# Altium project TL494_Card.PrjPcb
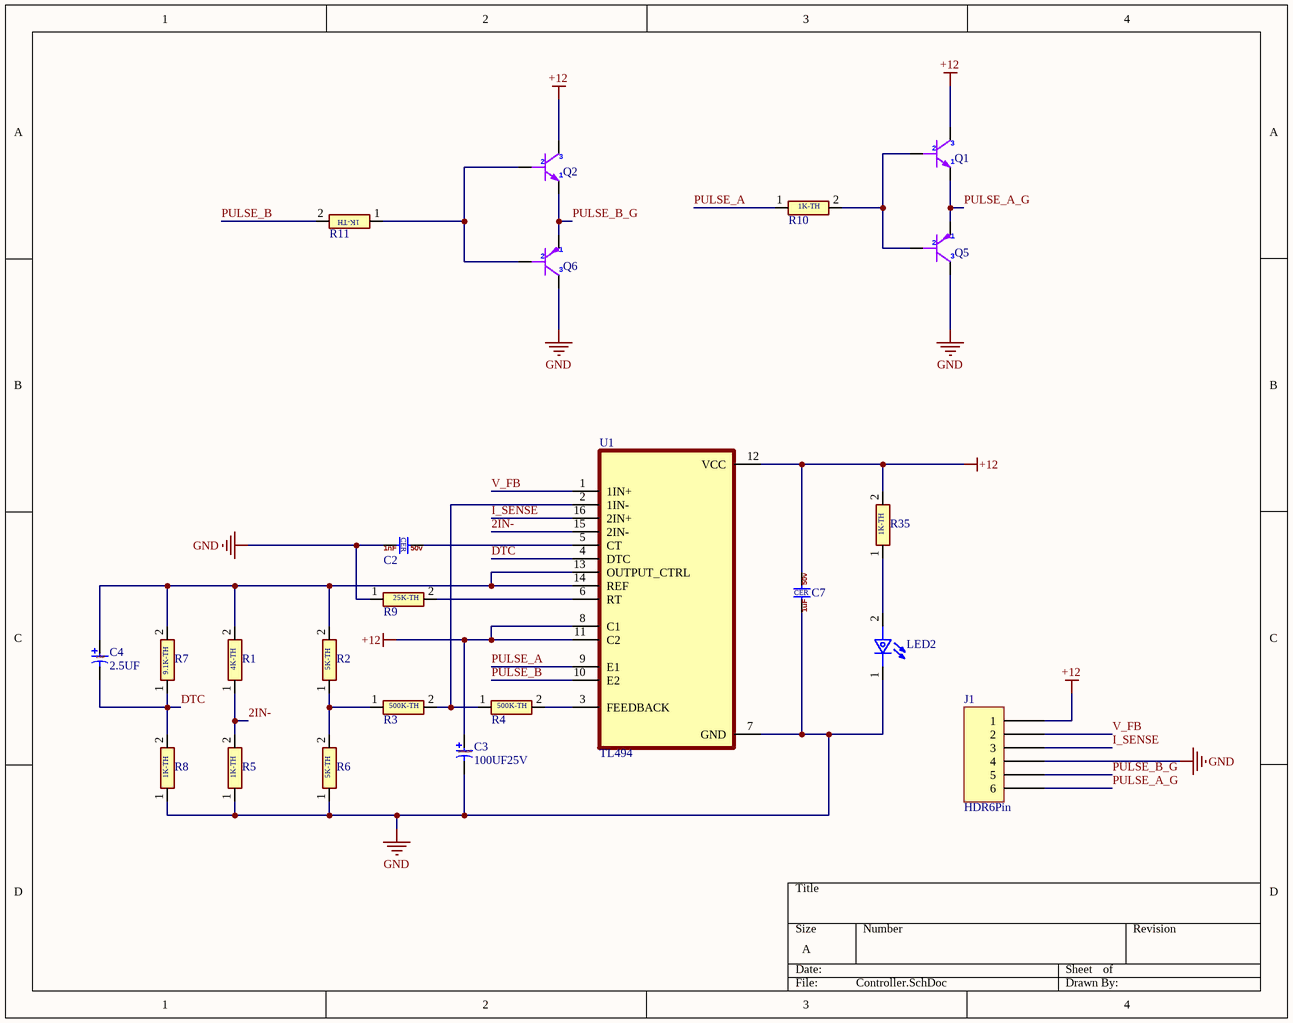
[diagram p0: Controller.SchDoc]
1 sheet, 23 parts. Net scope: global (net labels, ports and power ports of the same name join across sheets).
Board file: PCB1.PcbDoc

## Sheet Controller.SchDoc
size A; SheetNumber: 1; SheetTotal: 1; SPICEModelCacheHVBVXOZT: <root> / <DocumentId>HVBVXOZT</DocumentId> / </root>

### Parts
C2  1NFCER  [CAP-CER-2.54]  (value not drawn)
C3  100UF25V  [CAP LS-1.5mm D4 H5]
C4  2.5UF  [CAP LS-1.5mm D4 H5]
C7  1UFCER  [CAP-CER-2.54]  (value not drawn)
J1  HDR6Pin  [HDR-TH_6P-P2.54-V-F]
LED2  LED White TH  [LED_5mm P5MM WHITE]  (value not drawn)
Q1  SS8050  [TO-92]  (value not drawn)
Q2  SS8050  [TO-92]  (value not drawn)
Q5  SS8550  [TO-92]  (value not drawn)
Q6  SS8550  [TO-92]  (value not drawn)
R1  4K  [RES-TH-7mm]  (value not drawn)
R2  5K  [RES-TH-7mm]  (value not drawn)
R3  500R  [RES-TH-7mm]  (value not drawn)
R4  500K  [RES-TH-7mm]  (value not drawn)
R5  1K  [RES-TH-7mm]  (value not drawn)
R6  5K  [RES-TH-7mm]  (value not drawn)
R7  9.1K  [RES-TH-7mm]  (value not drawn)
R8  1K  [RES-TH-7mm]  (value not drawn)
R9  25K  [RES-TH-7mm]  (value not drawn)
R10  1K  [RES-TH-7mm]  (value not drawn)
R11  1K  [RES-TH-7mm]  (value not drawn)
R35  1K  [RES-TH-7mm]  (value not drawn)
U1  TL494  [DIP-16]

### Nets
+12: C3.1 C7.2 J1.1 Q1.3(C) Q2.3(C) R35.2 U1.8(C1) U1.11(C2) U1.12(VCC)
GND: C2.1 C3.2 C7.1 J1.4 LED2.1 Q5.3(C) Q6.3(C) R5.1 R6.1 R8.1 R9.1 U1.7(GND)
2IN-: R1.1 R5.2 U1.15(2IN-)
DTC: C4.2 R7.1 R8.2 U1.4(DTC)
I_SENSE: J1.3 U1.16(2IN+)
PULSE_A: R10.1 U1.9(E1)
PULSE_A_G: J1.6 Q1.1(E) Q5.1(E)
PULSE_B: R11.2 U1.10(E2)
PULSE_B_G: J1.5 Q2.1(E) Q6.1(E)
V_FB: J1.2 U1.1(1IN+)
NetC2_2: C2.2 U1.5(CT)
NetC4_1: C4.1 R1.2 R2.2 R7.2 U1.13(OUTPUT_CTRL) U1.14(REF)
NetLED2_2: LED2.2 R35.1
NetQ1_2: Q1.2(B) Q5.2(B) R10.2
NetQ2_2: Q2.2(B) Q6.2(B) R11.1
NetR2_1: R2.1 R3.1 R6.2
NetR3_2: R3.2 R4.1 U1.2(1IN-)
NetR4_2: R4.2 U1.3(FEEDBACK)
NetR9_2: R9.2 U1.6(RT)

### Notes on the sheet
- (in symbol 1K) 1K-TH
- (in symbol 1NFCER) CER; 1nF; 50v
- (in symbol 1UFCER) 50v; CER; 1uF
- (in symbol 2.5UF) 2.5uF
- (in symbol 4K) 4K-TH
- (in symbol 5K) 5K-TH
- (in symbol 9.1K) 9.1K-TH
- (in symbol 25K) 25K-TH
- (in symbol 100UF25V) 100u25v
- (in symbol 500K) 500K-TH
- (in symbol 500R) 500K-TH

### Library data of the parts
C2 = 1NFCER: CAP: CER 1UF 50V X7R 1206; LCSC Part #: C1848; Unit Price: 0.0104
C3 = 100UF25V: CAP TH AL: 100U 25V; LCSC Part #: C43351; Unit Price: 0.0057
C4 = 2.5UF: CAP TH AL: 2.5UF; LCSC Part #: C43351; Unit Price: 0.0057
C7 = 1UFCER: CAP: CER 1UF 50V; LCSC Part #: C1848; Unit Price: 0.0104
J1 = HDR6Pin: HEADER: 1*6P Male
LED2 = LED White TH: LED: White, Through Hole, T-1 3/4 (5mm), 30 mA, 2.1V / LS-5MM; LCSC Part #: C7470709
Q1 Q2 = SS8050: Transistor: 25V 300mW 120@100mA,1V 1.5A NPN SOT-23; LCSC Part #: C59205; Unit Price: 0.0048
Q5 Q6 = SS8550: Transistor: 25V 200mW 120@100mA,1V 1.5A PNP SOT-23 EVVO; LCSC Part #: C59205; Unit Price: 0.0048
R1 = 4K: RES TH: 4K
R2 R6 = 5K: RES TH: 5K
R3 = 500R: RES TH: 500R
R4 = 500K: RES TH: 500K
R5 R8 R10 R11 R35 = 1K: RES TH: 1K
R7 = 9.1K: RES TH: 9.1K
R9 = 25K: RES TH: 25K
U1 = TL494: IC: PWM Controllar